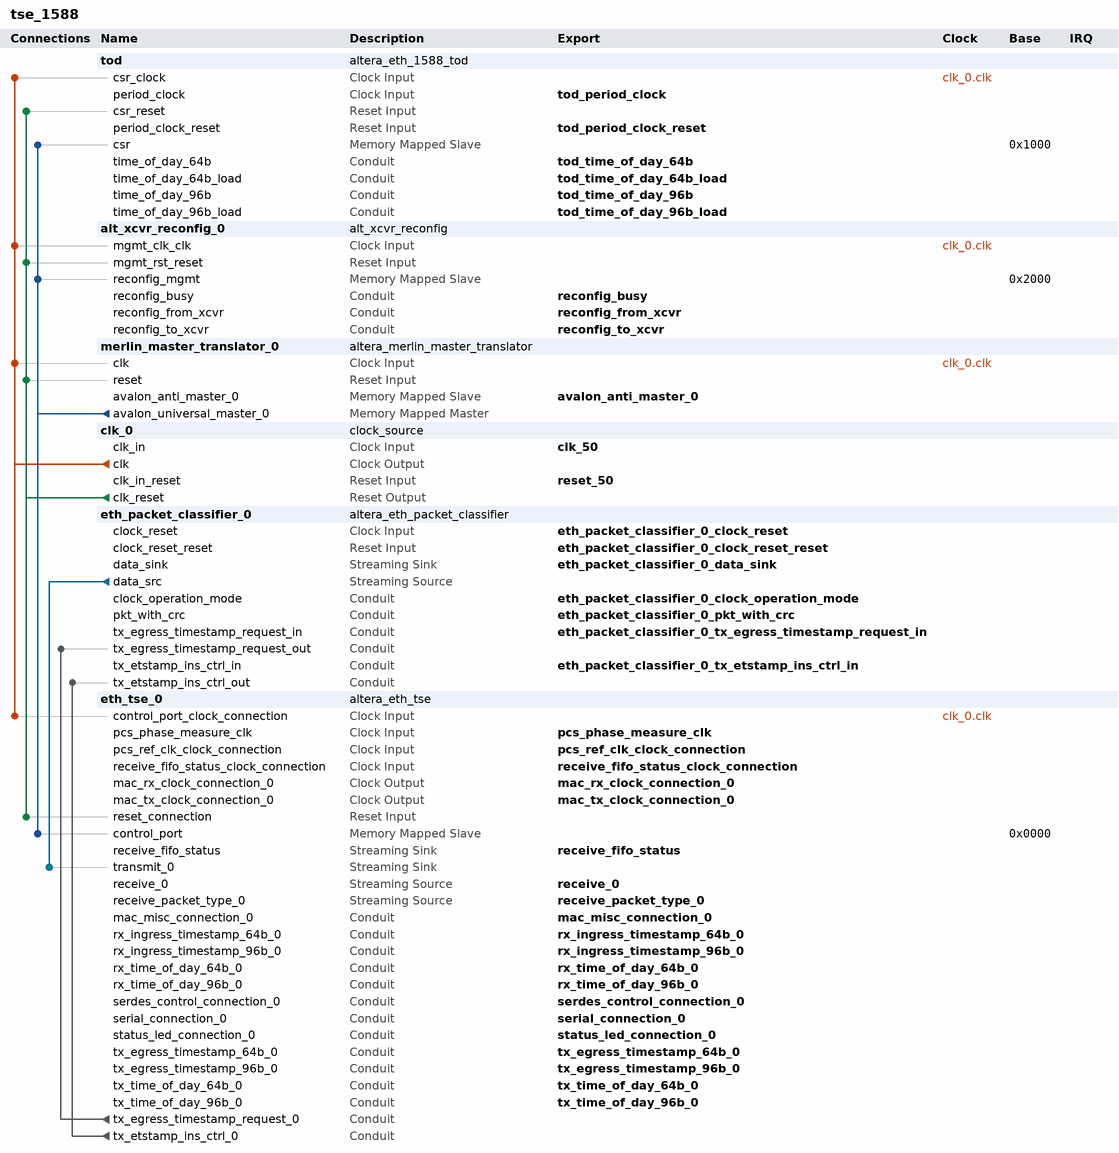
[diagram p0: system contents]
# Platform Designer (Qsys) system tse_1588, Stratix V Unknown
# Parameters at their usual value, and those the tool derives, are not listed.
package require -exact qsys 13.0
create_system tse_1588
set_project_property DEVICE_FAMILY {Stratix V}
set_project_property DEVICE Unknown

add_instance tod altera_eth_1588_tod 13.0
set_instance_parameter_value tod DEFAULT_NSEC_PERIOD 8
set_instance_parameter_value tod DEFAULT_FNSEC_PERIOD 0
set_instance_parameter_value tod DEFAULT_NSEC_ADJPERIOD 8
set_instance_parameter_value tod DEFAULT_FNSEC_ADJPERIOD 0

add_instance alt_xcvr_reconfig_0 alt_xcvr_reconfig 13.0
set_instance_parameter_value alt_xcvr_reconfig_0 device_family {Stratix V}
set_instance_parameter_value alt_xcvr_reconfig_0 number_of_reconfig_interfaces 2
set_instance_parameter_value alt_xcvr_reconfig_0 enable_analog 1
set_instance_parameter_value alt_xcvr_reconfig_0 enable_adce 0

add_instance merlin_master_translator_0 altera_merlin_master_translator 13.0
set_instance_parameter_value merlin_master_translator_0 AV_ADDRESS_W 32
set_instance_parameter_value merlin_master_translator_0 AV_DATA_W 32
set_instance_parameter_value merlin_master_translator_0 AV_BURSTCOUNT_W 3
set_instance_parameter_value merlin_master_translator_0 AV_BYTEENABLE_W 4
set_instance_parameter_value merlin_master_translator_0 UAV_ADDRESS_W 32
set_instance_parameter_value merlin_master_translator_0 UAV_BURSTCOUNT_W 3
set_instance_parameter_value merlin_master_translator_0 AV_READLATENCY 0
set_instance_parameter_value merlin_master_translator_0 AV_WRITE_WAIT 0
set_instance_parameter_value merlin_master_translator_0 AV_READ_WAIT 0
set_instance_parameter_value merlin_master_translator_0 AV_DATA_HOLD 0
set_instance_parameter_value merlin_master_translator_0 AV_SETUP_WAIT 0
set_instance_parameter_value merlin_master_translator_0 USE_READDATA 1
set_instance_parameter_value merlin_master_translator_0 USE_WRITEDATA 1
set_instance_parameter_value merlin_master_translator_0 USE_READ 1
set_instance_parameter_value merlin_master_translator_0 USE_WRITE 1
set_instance_parameter_value merlin_master_translator_0 USE_BEGINBURSTTRANSFER 0
set_instance_parameter_value merlin_master_translator_0 USE_BEGINTRANSFER 0
set_instance_parameter_value merlin_master_translator_0 USE_BYTEENABLE 0
set_instance_parameter_value merlin_master_translator_0 USE_CHIPSELECT 0
set_instance_parameter_value merlin_master_translator_0 USE_ADDRESS 1
set_instance_parameter_value merlin_master_translator_0 USE_BURSTCOUNT 0
set_instance_parameter_value merlin_master_translator_0 USE_DEBUGACCESS 0
set_instance_parameter_value merlin_master_translator_0 USE_CLKEN 0
set_instance_parameter_value merlin_master_translator_0 USE_READDATAVALID 0
set_instance_parameter_value merlin_master_translator_0 USE_WAITREQUEST 1
set_instance_parameter_value merlin_master_translator_0 USE_LOCK 0
set_instance_parameter_value merlin_master_translator_0 AV_SYMBOLS_PER_WORD 4
set_instance_parameter_value merlin_master_translator_0 AV_ADDRESS_SYMBOLS 1
set_instance_parameter_value merlin_master_translator_0 AV_BURSTCOUNT_SYMBOLS 1
set_instance_parameter_value merlin_master_translator_0 AV_CONSTANT_BURST_BEHAVIOR 0
set_instance_parameter_value merlin_master_translator_0 UAV_CONSTANT_BURST_BEHAVIOR 0
set_instance_parameter_value merlin_master_translator_0 AV_LINEWRAPBURSTS 0
set_instance_parameter_value merlin_master_translator_0 AV_MAX_PENDING_READ_TRANSACTIONS 64
set_instance_parameter_value merlin_master_translator_0 AV_BURSTBOUNDARIES 0
set_instance_parameter_value merlin_master_translator_0 AV_INTERLEAVEBURSTS 0
set_instance_parameter_value merlin_master_translator_0 AV_BITS_PER_SYMBOL 8
set_instance_parameter_value merlin_master_translator_0 AV_ISBIGENDIAN 0
set_instance_parameter_value merlin_master_translator_0 AV_ADDRESSGROUP 0
set_instance_parameter_value merlin_master_translator_0 UAV_ADDRESSGROUP 0
set_instance_parameter_value merlin_master_translator_0 AV_REGISTEROUTGOINGSIGNALS 0
set_instance_parameter_value merlin_master_translator_0 AV_REGISTERINCOMINGSIGNALS 0
set_instance_parameter_value merlin_master_translator_0 AV_ALWAYSBURSTMAXBURST 0

add_instance clk_0 clock_source 13.0
set_instance_parameter_value clk_0 clockFrequency 50000000

add_instance eth_packet_classifier_0 altera_eth_packet_classifier 13.0
set_instance_parameter_value eth_packet_classifier_0 TSTAMP_FP_WIDTH 4
set_instance_parameter_value eth_packet_classifier_0 SYMBOLSPERBEAT 1
set_instance_parameter_value eth_packet_classifier_0 BITSPERSYMBOL 8

add_instance eth_tse_0 altera_eth_tse 13.0
set_instance_parameter_value eth_tse_0 core_variation MAC_PCS
set_instance_parameter_value eth_tse_0 ifGMII MII_GMII
set_instance_parameter_value eth_tse_0 enable_use_internal_fifo false
set_instance_parameter_value eth_tse_0 transceiver_type GXB
set_instance_parameter_value eth_tse_0 enable_hd_logic false
set_instance_parameter_value eth_tse_0 stat_cnt_ena true
set_instance_parameter_value eth_tse_0 enable_shift16 false
set_instance_parameter_value eth_tse_0 enable_mac_flow_ctrl false
set_instance_parameter_value eth_tse_0 enable_magic_detect true
set_instance_parameter_value eth_tse_0 useMDIO false
set_instance_parameter_value eth_tse_0 mdio_clk_div 40
set_instance_parameter_value eth_tse_0 ing_addr 11
set_instance_parameter_value eth_tse_0 enable_sgmii true
set_instance_parameter_value eth_tse_0 enable_timestamping true
set_instance_parameter_value eth_tse_0 enable_ptp_1step true

# connections
add_connection clk_0.clk alt_xcvr_reconfig_0.mgmt_clk_clk clock
add_connection clk_0.clk eth_tse_0.control_port_clock_connection clock
add_connection clk_0.clk merlin_master_translator_0.clk clock
add_connection clk_0.clk tod.csr_clock clock
add_connection clk_0.clk_reset alt_xcvr_reconfig_0.mgmt_rst_reset reset
add_connection clk_0.clk_reset eth_tse_0.reset_connection reset
add_connection clk_0.clk_reset merlin_master_translator_0.reset reset
add_connection clk_0.clk_reset tod.csr_reset reset
add_connection merlin_master_translator_0.avalon_universal_master_0 alt_xcvr_reconfig_0.reconfig_mgmt avalon
set_connection_parameter_value merlin_master_translator_0.avalon_universal_master_0/alt_xcvr_reconfig_0.reconfig_mgmt baseAddress 0x2000
add_connection merlin_master_translator_0.avalon_universal_master_0 eth_tse_0.control_port avalon
set_connection_parameter_value merlin_master_translator_0.avalon_universal_master_0/eth_tse_0.control_port baseAddress 0x0000
add_connection merlin_master_translator_0.avalon_universal_master_0 tod.csr avalon
set_connection_parameter_value merlin_master_translator_0.avalon_universal_master_0/tod.csr baseAddress 0x1000
add_connection eth_packet_classifier_0.data_src eth_tse_0.transmit_0 avalon_streaming
add_connection eth_tse_0.tx_egress_timestamp_request_0 eth_packet_classifier_0.tx_egress_timestamp_request_out conduit
add_connection eth_tse_0.tx_etstamp_ins_ctrl_0 eth_packet_classifier_0.tx_etstamp_ins_ctrl_out conduit

# exported interfaces
add_interface tod_period_clock clock sink
set_interface_property tod_period_clock EXPORT_OF tod.period_clock
add_interface tod_period_clock_reset reset sink
set_interface_property tod_period_clock_reset EXPORT_OF tod.period_clock_reset
add_interface reconfig_busy conduit end
set_interface_property reconfig_busy EXPORT_OF alt_xcvr_reconfig_0.reconfig_busy
add_interface clk_50 clock sink
set_interface_property clk_50 EXPORT_OF clk_0.clk_in
add_interface reset_50 reset sink
set_interface_property reset_50 EXPORT_OF clk_0.clk_in_reset
add_interface avalon_anti_master_0 avalon slave
set_interface_property avalon_anti_master_0 EXPORT_OF merlin_master_translator_0.avalon_anti_master_0
add_interface tod_time_of_day_96b conduit end
set_interface_property tod_time_of_day_96b EXPORT_OF tod.time_of_day_96b
add_interface tod_time_of_day_64b conduit end
set_interface_property tod_time_of_day_64b EXPORT_OF tod.time_of_day_64b
add_interface eth_packet_classifier_0_clock_reset clock sink
set_interface_property eth_packet_classifier_0_clock_reset EXPORT_OF eth_packet_classifier_0.clock_reset
add_interface eth_packet_classifier_0_data_sink avalon_streaming sink
set_interface_property eth_packet_classifier_0_data_sink EXPORT_OF eth_packet_classifier_0.data_sink
add_interface eth_packet_classifier_0_clock_reset_reset reset sink
set_interface_property eth_packet_classifier_0_clock_reset_reset EXPORT_OF eth_packet_classifier_0.clock_reset_reset
add_interface eth_packet_classifier_0_clock_operation_mode conduit end
set_interface_property eth_packet_classifier_0_clock_operation_mode EXPORT_OF eth_packet_classifier_0.clock_operation_mode
add_interface eth_packet_classifier_0_pkt_with_crc conduit end
set_interface_property eth_packet_classifier_0_pkt_with_crc EXPORT_OF eth_packet_classifier_0.pkt_with_crc
add_interface eth_packet_classifier_0_tx_egress_timestamp_request_in conduit end
set_interface_property eth_packet_classifier_0_tx_egress_timestamp_request_in EXPORT_OF eth_packet_classifier_0.tx_egress_timestamp_request_in
add_interface eth_packet_classifier_0_tx_etstamp_ins_ctrl_in conduit end
set_interface_property eth_packet_classifier_0_tx_etstamp_ins_ctrl_in EXPORT_OF eth_packet_classifier_0.tx_etstamp_ins_ctrl_in
add_interface tod_time_of_day_96b_load conduit end
set_interface_property tod_time_of_day_96b_load EXPORT_OF tod.time_of_day_96b_load
add_interface tod_time_of_day_64b_load conduit end
set_interface_property tod_time_of_day_64b_load EXPORT_OF tod.time_of_day_64b_load
add_interface receive_fifo_status_clock_connection clock sink
set_interface_property receive_fifo_status_clock_connection EXPORT_OF eth_tse_0.receive_fifo_status_clock_connection
add_interface receive_fifo_status avalon_streaming sink
set_interface_property receive_fifo_status EXPORT_OF eth_tse_0.receive_fifo_status
add_interface mac_rx_clock_connection_0 clock source
set_interface_property mac_rx_clock_connection_0 EXPORT_OF eth_tse_0.mac_rx_clock_connection_0
add_interface mac_tx_clock_connection_0 clock source
set_interface_property mac_tx_clock_connection_0 EXPORT_OF eth_tse_0.mac_tx_clock_connection_0
add_interface receive_0 avalon_streaming source
set_interface_property receive_0 EXPORT_OF eth_tse_0.receive_0
add_interface receive_packet_type_0 avalon_streaming source
set_interface_property receive_packet_type_0 EXPORT_OF eth_tse_0.receive_packet_type_0
add_interface rx_time_of_day_96b_0 conduit end
set_interface_property rx_time_of_day_96b_0 EXPORT_OF eth_tse_0.rx_time_of_day_96b_0
add_interface rx_time_of_day_64b_0 conduit end
set_interface_property rx_time_of_day_64b_0 EXPORT_OF eth_tse_0.rx_time_of_day_64b_0
add_interface tx_time_of_day_96b_0 conduit end
set_interface_property tx_time_of_day_96b_0 EXPORT_OF eth_tse_0.tx_time_of_day_96b_0
add_interface tx_time_of_day_64b_0 conduit end
set_interface_property tx_time_of_day_64b_0 EXPORT_OF eth_tse_0.tx_time_of_day_64b_0
add_interface rx_ingress_timestamp_96b_0 conduit end
set_interface_property rx_ingress_timestamp_96b_0 EXPORT_OF eth_tse_0.rx_ingress_timestamp_96b_0
add_interface rx_ingress_timestamp_64b_0 conduit end
set_interface_property rx_ingress_timestamp_64b_0 EXPORT_OF eth_tse_0.rx_ingress_timestamp_64b_0
add_interface tx_egress_timestamp_96b_0 conduit end
set_interface_property tx_egress_timestamp_96b_0 EXPORT_OF eth_tse_0.tx_egress_timestamp_96b_0
add_interface tx_egress_timestamp_64b_0 conduit end
set_interface_property tx_egress_timestamp_64b_0 EXPORT_OF eth_tse_0.tx_egress_timestamp_64b_0
add_interface mac_misc_connection_0 conduit end
set_interface_property mac_misc_connection_0 EXPORT_OF eth_tse_0.mac_misc_connection_0
add_interface pcs_ref_clk_clock_connection clock sink
set_interface_property pcs_ref_clk_clock_connection EXPORT_OF eth_tse_0.pcs_ref_clk_clock_connection
add_interface pcs_phase_measure_clk clock sink
set_interface_property pcs_phase_measure_clk EXPORT_OF eth_tse_0.pcs_phase_measure_clk
add_interface status_led_connection_0 conduit end
set_interface_property status_led_connection_0 EXPORT_OF eth_tse_0.status_led_connection_0
add_interface serdes_control_connection_0 conduit end
set_interface_property serdes_control_connection_0 EXPORT_OF eth_tse_0.serdes_control_connection_0
add_interface serial_connection_0 conduit end
set_interface_property serial_connection_0 EXPORT_OF eth_tse_0.serial_connection_0
add_interface reconfig_to_xcvr conduit end
set_interface_property reconfig_to_xcvr EXPORT_OF alt_xcvr_reconfig_0.reconfig_to_xcvr
add_interface reconfig_from_xcvr conduit end
set_interface_property reconfig_from_xcvr EXPORT_OF alt_xcvr_reconfig_0.reconfig_from_xcvr

set_interconnect_requirement {$system} qsys_mm.maxAdditionalLatency 1
set_interconnect_requirement {$system} qsys_mm.clockCrossingAdapter HANDSHAKE

save_system tse_1588.qsys
